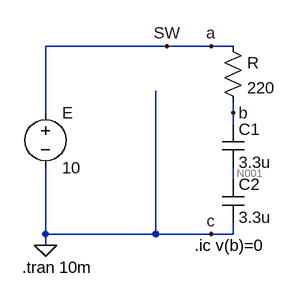
[diagram p0: schematic Draft11.asc]
Draft11.asc, the LTspice schematic file:
Version 4
SHEET 1 880 680
WIRE 240 64 64 64
WIRE 304 64 240 64
WIRE 336 64 304 64
WIRE 64 160 64 64
WIRE 336 160 336 144
WIRE 336 176 336 160
WIRE 336 256 336 240
WIRE 64 336 64 240
WIRE 224 336 224 128
WIRE 224 336 64 336
WIRE 304 336 224 336
WIRE 336 336 336 320
WIRE 336 336 304 336
WIRE 64 352 64 336
FLAG 64 352 0
FLAG 240 64 SW
FLAG 304 64 a
FLAG 336 160 b
FLAG 304 336 c
SYMBOL voltage 64 144 R0
WINDOW 123 0 0 Left 0
WINDOW 39 0 0 Left 0
SYMATTR InstName E
SYMATTR Value 10
SYMBOL res 320 48 R0
SYMATTR InstName R
SYMATTR Value 220
SYMATTR SpiceLine tol=1 pwr=0.1
SYMBOL cap 320 176 R0
SYMATTR InstName C1
SYMATTR Value 3.3u
SYMBOL cap 320 256 R0
SYMATTR InstName C2
SYMATTR Value 3.3u
TEXT 280 352 Left 2 !.ic v(b)=0
TEXT 30 384 Left 2 !.tran 10m

The netlist it stands for:
* Draft11.asc
V§E a 0 10
R a b 220 tol=1 pwr=0.1
C1 b N001 3.3u
C2 N001 0 3.3u
.ic v(b)=0
.tran 10m
.backanno
.end

* Results of the author's LTspice run, read from the files saved beside the schematic
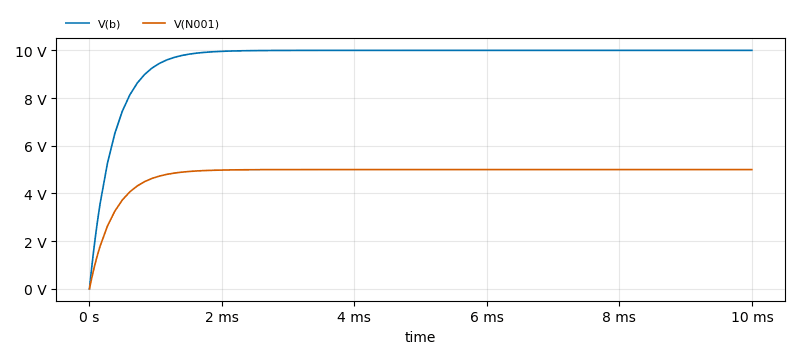
[diagram p1: Transient Analysis of Draft11.asc, plotted from the saved traces]
* Transient Analysis, 1 run:
*   V(b): min 0 V, max 10 V, average 9.635 V, rms 9.723 V, last 10 V
*   V(N001): min 0 V, max 5 V, average 4.818 V, rms 4.862 V, last 5 V